# Altium schematic sheet SCH_V2.0.SchDoc
size A4; SheetNumber: 1; SheetTotal: 1
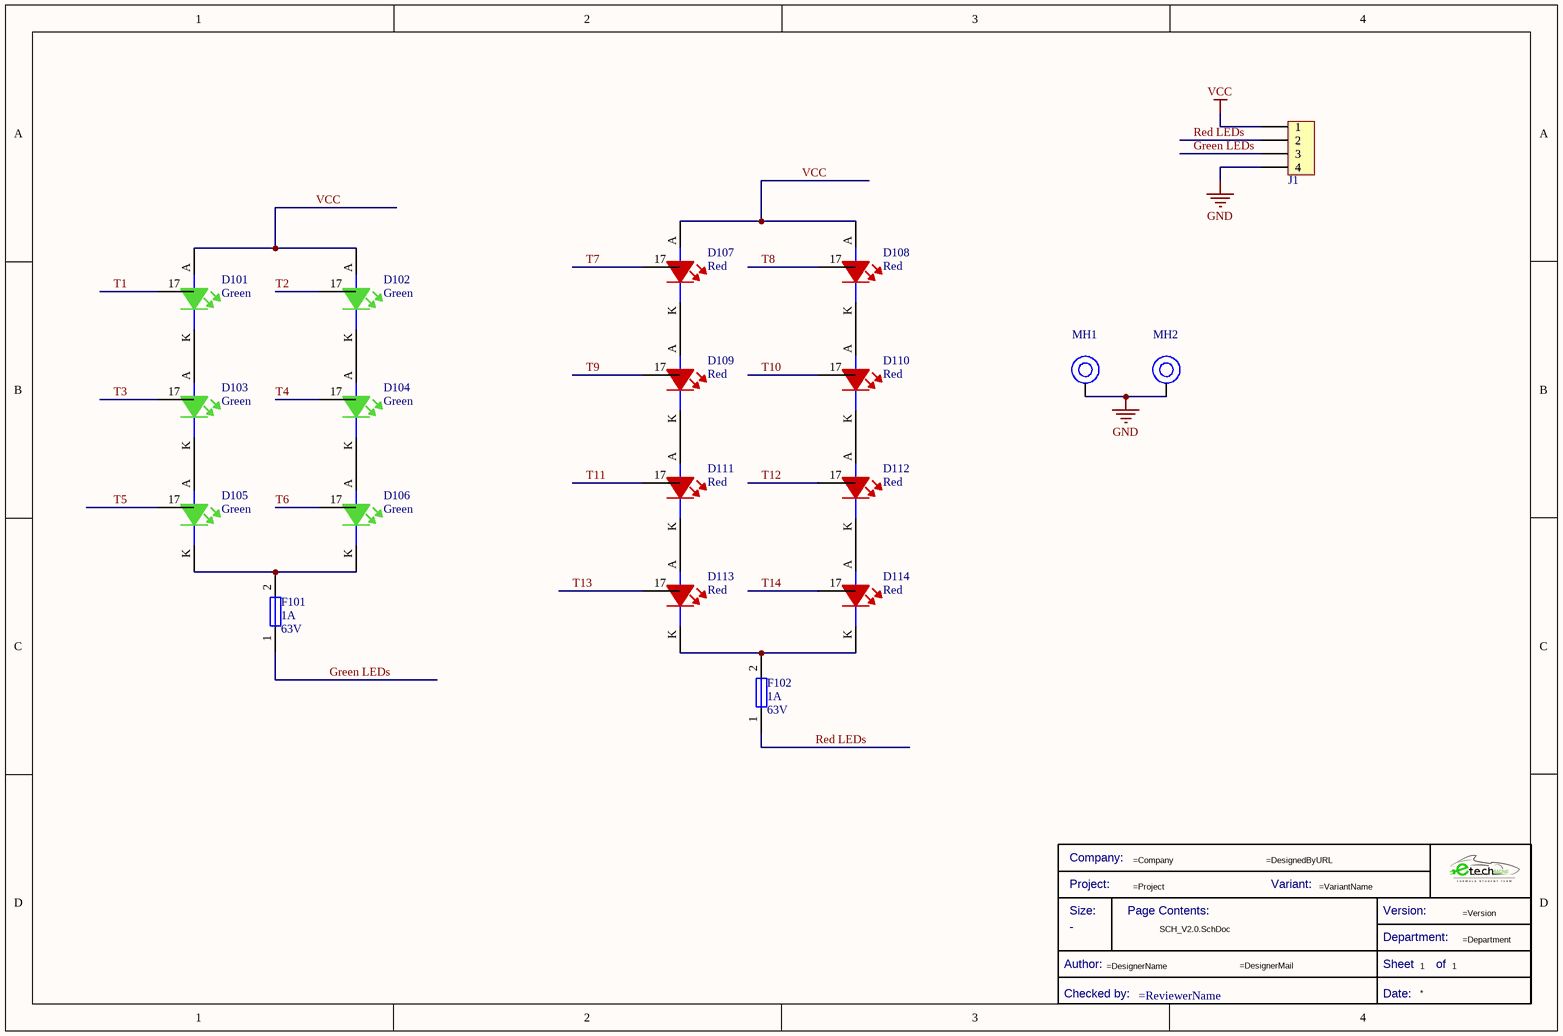
[diagram p0: SCH_V2.0.SchDoc]

## Parts
*  Title Block_template  (value not drawn)  (graphical)
D101  Color: Green  [LED_3535_WE - duplicate]  (hidden comment: 150353GS74500)
D102  Color: Green  [LED_3535_WE - duplicate]  (hidden comment: 150353GS74500)
D103  Color: Green  [LED_3535_WE - duplicate]  (hidden comment: 150353GS74500)
D104  Color: Green  [LED_3535_WE - duplicate]  (hidden comment: 150353GS74500)
D105  Color: Green  [LED_3535_WE - duplicate]  (hidden comment: 150353GS74500)
D106  Color: Green  [LED_3535_WE - duplicate]  (hidden comment: 150353GS74500)
D107  Color: Red  [LED_3535_WE - duplicate]  (hidden comment: 150353RS74500)
D108  Color: Red  [LED_3535_WE - duplicate]  (hidden comment: 150353RS74500)
D109  Color: Red  [LED_3535_WE - duplicate]  (hidden comment: 150353RS74500)
D110  Color: Red  [LED_3535_WE - duplicate]  (hidden comment: 150353RS74500)
D111  Color: Red  [LED_3535_WE - duplicate]  (hidden comment: 150353RS74500)
D112  Color: Red  [LED_3535_WE - duplicate]  (hidden comment: 150353RS74500)
D113  Color: Red  [LED_3535_WE - duplicate]  (hidden comment: 150353RS74500)
D114  Color: Red  [LED_3535_WE - duplicate]  (hidden comment: 150353RS74500)
F101  Current Rating: 1A  Voltage Rating (DC): 63V  [Fuse_1206]  (hidden comment: 0437001.WRA)
F102  Current Rating: 1A  Voltage Rating (DC): 63V  [Fuse_1206]  (hidden comment: 0437001.WRA)
J1  436500400  [J_MicroFit_1x4]  (value not drawn)
MH1  Mounting_Hole_M3  [Mounting_Hole_M3]  (value not drawn)
MH2  Mounting_Hole_M3  [Mounting_Hole_M3]  (value not drawn)

## Nets
GND: J1.4 MH1.1 MH2.1
VCC: D101.A D102.A D107.A D108.A J1.1
Green LEDs: F101.1 J1.3
Red LEDs: F102.1 J1.2
T1: D101.17
T2: D102.17
T3: D103.17
T4: D104.17
T5: D105.17
T6: D106.17
T7: D107.17
T8: D108.17
T9: D109.17
T10: D110.17
T11: D111.17
T12: D112.17
T13: D113.17
T14: D114.17
NetD101_K: D101.K D103.A
NetD102_K: D102.K D104.A
NetD103_K: D103.K D105.A
NetD104_K: D104.K D106.A
NetD105_K: D105.K D106.K F101.2
NetD107_K: D107.K D109.A
NetD108_K: D108.K D110.A
NetD109_K: D109.K D111.A
NetD110_K: D110.K D112.A
NetD111_K: D111.K D113.A
NetD112_K: D112.K D114.A
NetD113_K: D113.K D114.K F102.2

## Notes on the sheet
- (in symbol Title Block_template) Company:; Project:; Variant:; Size:; Page Contents:; Version:; Department:; Author:; Sheet; of; Checked by:; Date:

## Library data of the parts
* = Title Block_template: Standard Title Block; .Creator: GP; Category: Title Block; .PCBcheck: GP; .SCHcheck: GP; Checked by:: =ReviewerName; Size: -
D101-D106 = LEDGS-3535-85_DUPLICATE: High Brightness LED, WL-SMDC Series, 525 nm, Green, 85 lm, 350 mA; Manufacturer: Wurth Electronics; Forward Current: 1A; Wavelength: 525nm; Test Temperature: 25°C; Viewing Angle: 125°; Thermal Resistance of Package: 8°C/W; Luminous Flux: 85lm; Test Current: 350mA; Forward Voltage: 3.4V; .Creator: GP; Supplier 1: Digi-Key; Manufacturer Part Number: 150353GS74500; RoHS: Yes; Pricing 1: 1=3,24000, 50=2,85700, 100=2,34700, 500=2,08000 (USD); Mount: Surface Mount; Case/Package: SMD/SMT; Packaging: Cut Tape; Max Current Rating: 1A; REACH SVHC: Unknown; RoHS Compliant: Yes; ComponentLink1URL: http://www.farnell.com/datasheets/1886832.pdf?src-supplier=Farnell; ComponentLink1Description: http://www.farnell.com/datasheets/1886832.pdf?src-supplier=Farnell; ComponentLink2URL: http://www.farnell.com/datasheets/1886832.pdf?src-supplier=Element14; ComponentLink2Description: http://www.farnell.com/datasheets/1886832.pdf?src-supplier=Element14; Supplier Part Number 1: 732-10350-1-ND; ComponentLink3Description: Where buy it; ComponentLink3URL: https://www.we-online.com/catalog/en/WL-SMDC?sq=150353rs74500&sp=https%3A%2F%2Fwww.we-online.com%2Fweb%2Fen%2Fwuerth_elektronik%2Fsearchpage.php%3Fsearch%3D150353rs74500#150353GS74500
D107-D114 = LEDRS-3535-55_DUPLICATE: High Brightness Led, Wl-Smdc Series, 625 Nm, Red, 55 Lm, 350 Ma; Manufacturer: Wurth Electronics; Forward Current: 700mA; Wavelength: 625nm; Test Temperature: 25°C; Viewing Angle: 125°; Thermal Resistance of Package: 10°C/W; Luminous Flux: 55lm; Test Current: 350mA; Forward Voltage: 2.2V; .Creator: GP; Supplier 1: RSComponents; Manufacturer Part Number: 150353RS74500; RoHS: Yes; Stock 1: 1; Pricing 1: 5=1,40500 (USD); Mount: Surface Mount; Case/Package: SMD/SMT; Packaging: Cut Tape; Max Current Rating: 700mA; REACH SVHC: Unknown; RoHS Compliant: Yes; ComponentLink1URL: http://www.farnell.com/datasheets/1886833.pdf?src-supplier=Farnell; ComponentLink1Description: http://www.farnell.com/datasheets/1886833.pdf?src-supplier=Farnell; ComponentLink2URL: http://www.farnell.com/datasheets/1886833.pdf?src-supplier=Element14; ComponentLink2Description: http://www.farnell.com/datasheets/1886833.pdf?src-supplier=Element14; Supplier Part Number 1: 9008911; ComponentLink3Description: Where buy it; ComponentLink3URL: https://www.we-online.com/catalog/en/WL-SMDC?sq=150353rs74500&sp=https%3A%2F%2Fwww.we-online.com%2Fweb%2Fen%2Fwuerth_elektronik%2Fsearchpage.php%3Fsearch%3D150353rs74500#150353RS74500
F101 F102 = Fuse_1A_63V_1206: Fuse Chip Fast Acting 1A 63V SMD Solder Pad 1206 Ceramic T/R Automotive; Manufacturer: Littelfuse; Fuse Type: Board Mount (Cartridge Style Excluded); Approvals: CSA,cURus; .Creator: DO; Supplier 1: Digi-Key; Manufacturer Part Number: 0437001.WRA; RoHS: Yes; Category: Fuses; Stock 1: 5820; Pricing 1: 1=1,52000, 5=1,47000, 10=1,37600, 50=1,13860, 100=0,94880, 250=0,92508, 500=0,78276, 1000=0,68788 (USD); Mount: Surface Mount; Case/Package: 1206; Case Code (Imperial): 1206; Case Code (Metric): 3216; Min Operating Temperature: -55°C; Max Operating Temperature: 150°C; Packaging: Tape and Reel; Voltage Rating (AC): 63V; ComponentLink1URL: https://www.littelfuse.com/~/media/electronics/datasheets/fuses/littelfuse_fuse_437a_datasheet.pdf.pdf?src-supplier=Digi-Key; ComponentLink1Description: https://www.littelfuse.com/~/media/electronics/datasheets/fuses/littelfuse_fuse_437a_datasheet.pdf.pdf?src-supplier=Digi-Key; Supplier Part Number 1: F10001CT-ND; ComponentLink2Description: Where buy it; ComponentLink2URL: https://www.mouser.es/ProductDetail/Littelfuse/0437001WRA?qs=DXv0QSHKF4z9CJhPXjxR%252BA%3D%3D
J1 = J_MicroFit_1x4: Connector Wire to Board Header 4 Position 3mm Solder Right Angle Thru-Hole Tray; Manufacturer 1: Molex; Manufacturer Part Number 1: 43650-0400; Current Rating: 5A; Voltage Rating: 600V; Contact Resistance: 10mR; Connector Type: Plug; Number of Positions: 4; Gender: Male; Voltage Rating (DC): 250V; Glow Wire Compliant: Compliant; Supplier 1: Farnell; RoHS: Yes; Category: Headers and Wire Housings; Stock 1: 4623; Pricing 1: 1=1,24000, 10=1,22000, 50=1,19000, 100=1,17000, 500=1,14000, 1000=1,12000 (EUR); Mount: Through Hole,Cable; Contact Material: Brass,Copper Alloy; Contact Plating: Tin; Color: Black; Housing Color: Black; Housing Material: Thermoplastic; Min Operating Temperature: -40°C; Max Operating Temperature: 105°C; Termination: Solder; Orientation: Right Angle; Number of Rows: 1; Packaging: Tray; Package Quantity: 2380; Number of Contacts: 4; Max Voltage Rating (AC): 600V; Number of Circuits: 4; Series: 43650; Length: 14.86mm; Height: 4.5mm; Pitch: 3mm; Depth: 3.6mm; Radiation Hardening: No; Halogen Free: Low Halogen; Lead Free: Contains Lead; Flammability Rating: UL94 V-0; RoHS Compliant: Yes; ComponentLink1URL: https://datasheet.ciiva.com/19462/884184-19462234.pdf?src-supplier=Jameco; ComponentLink1Description: https://datasheet.ciiva.com/19462/884184-19462234.pdf?src-supplier=Jameco; ComponentLink2URL: https://datasheet.ciiva.com/5151/0436500400-pcb-headers-148663-5151881.pdf?src-supplier=Mouser; ComponentLink2Description: https://datasheet.ciiva.com/5151/0436500400-pcb-headers-148663-5151881.pdf?src-supplier=Mouser; ComponentLink3URL: https://datasheet.ciiva.com/16085/0436500400-pcb-headers-16085752.pdf?src-supplier=Onlinecomponents.com; ComponentLink3Description: https://datasheet.ciiva.com/16085/0436500400-pcb-headers-16085752.pdf?src-supplier=Onlinecomponents.com; ComponentLink4URL: https://datasheet.ciiva.com/11748/0900766b80d6135b-11748178.pdf?src-supplier=RSComponents; ComponentLink4Description: https://datasheet.ciiva.com/11748/0900766b80d6135b-11748178.pdf?src-supplier=RSComponents; ComponentLink5URL: https://datasheet.ciiva.com/30221/142510436500400-pcb-headers-30221164.pdf?src-supplier=Onlinecomponents.com; ComponentLink5Description: https://datasheet.ciiva.com/30221/142510436500400-pcb-headers-30221164.pdf?src-supplier=Onlinecomponents.com; ComponentLink6URL: https://datasheet.ciiva.com/17080/70266896-17080471.pdf?src-supplier=Allied+Electronics; ComponentLink6Description: https://datasheet.ciiva.com/17080/70266896-17080471.pdf?src-supplier=Allied+Electronics; ComponentLink7URL: https://datasheet.ciiva.com/7094/1946229-7094763.pdf?src-supplier=Newark; ComponentLink7Description: https://datasheet.ciiva.com/7094/1946229-7094763.pdf?src-supplier=Newark; ComponentLink8URL: https://datasheet.ciiva.com/9449/0436500400-pcb-headers-9449446.pdf?src-supplier=Avnet; ComponentLink8Description: https://datasheet.ciiva.com/9449/0436500400-pcb-headers-9449446.pdf?src-supplier=Avnet; Supplier Part Number 1: 1012232